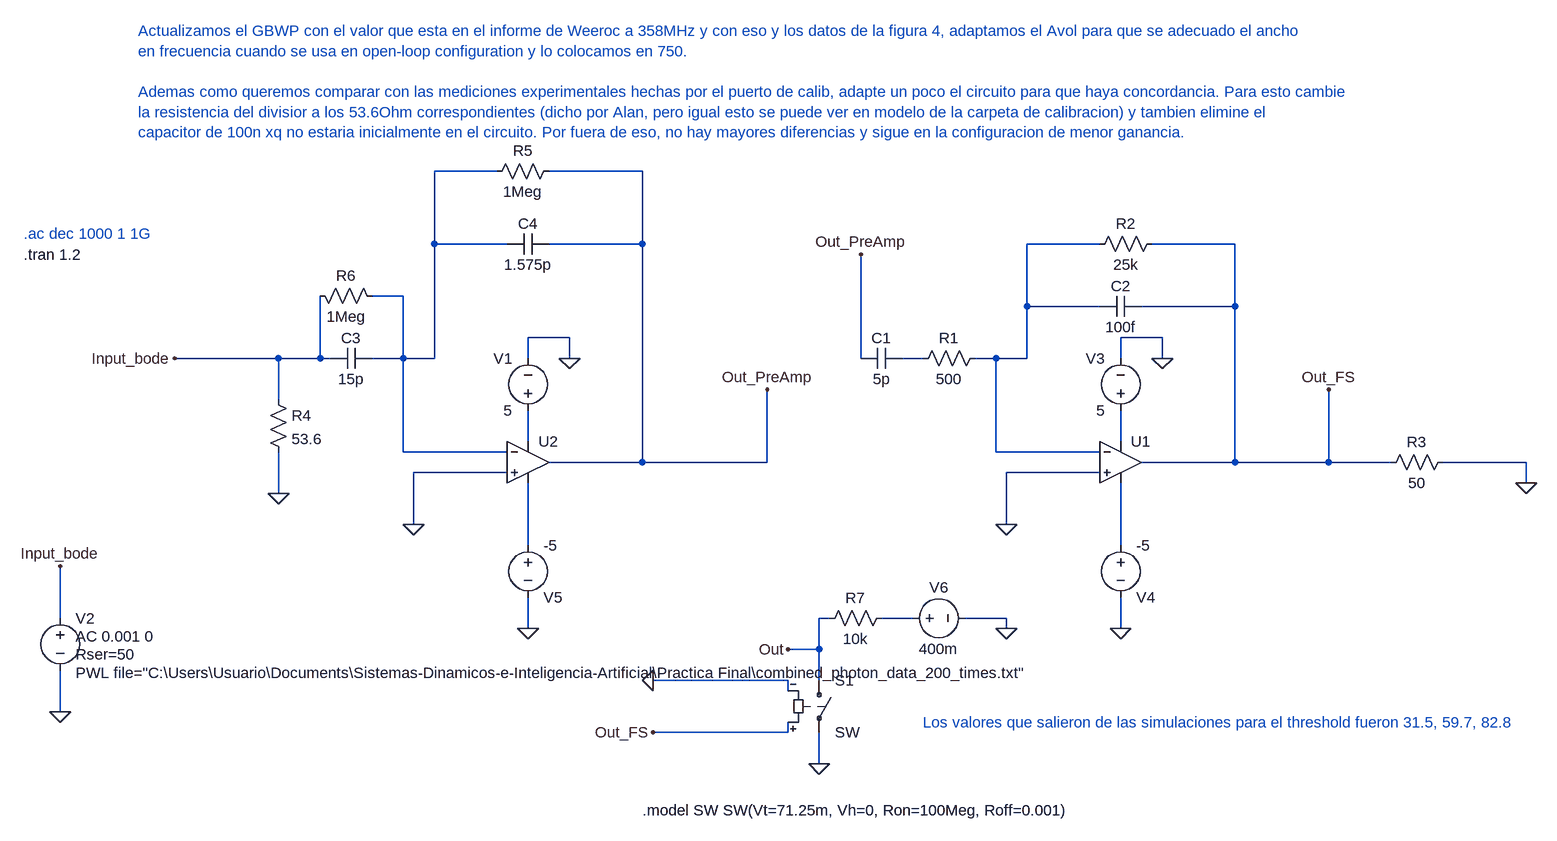
[diagram p0: schematic bode_circuito_completo_con_capacitores_en_preamp_inversor_v2.asc]
bode_circuito_completo_con_capacitores_en_preamp_inversor_v2.asc, the LTspice schematic file:
Version 4
SHEET 1 2516 1220
WIRE -832 -480 -928 -480
WIRE -608 -480 -752 -480
WIRE -928 -368 -928 -480
WIRE -816 -368 -928 -368
WIRE -608 -368 -608 -480
WIRE -608 -368 -752 -368
WIRE 96 -368 -16 -368
WIRE 304 -368 176 -368
WIRE -976 -288 -1024 -288
WIRE -16 -272 -16 -368
WIRE 96 -272 -16 -272
WIRE 304 -272 304 -368
WIRE 304 -272 160 -272
WIRE -720 -224 -784 -224
WIRE 192 -224 128 -224
WIRE -1168 -192 -1328 -192
WIRE -1104 -192 -1104 -288
WIRE -1104 -192 -1168 -192
WIRE -1088 -192 -1104 -192
WIRE -976 -192 -976 -288
WIRE -976 -192 -1024 -192
WIRE -928 -192 -928 -368
WIRE -928 -192 -976 -192
WIRE -784 -192 -784 -224
WIRE -720 -192 -720 -224
WIRE -272 -192 -272 -352
WIRE -176 -192 -208 -192
WIRE -64 -192 -96 -192
WIRE -16 -192 -16 -272
WIRE -16 -192 -64 -192
WIRE 128 -192 128 -224
WIRE 192 -192 192 -224
WIRE -1168 -128 -1168 -192
WIRE -784 -64 -784 -112
WIRE 128 -64 128 -112
WIRE -976 -48 -976 -192
WIRE -816 -48 -976 -48
WIRE -64 -48 -64 -192
WIRE 96 -48 -64 -48
WIRE -608 -32 -608 -368
WIRE -608 -32 -752 -32
WIRE -416 -32 -416 -144
WIRE -416 -32 -608 -32
WIRE 304 -32 304 -272
WIRE 304 -32 160 -32
WIRE 448 -32 448 -144
WIRE 448 -32 304 -32
WIRE 544 -32 448 -32
WIRE 752 -32 624 -32
WIRE -816 -16 -960 -16
WIRE 96 -16 -48 -16
WIRE 752 0 752 -32
WIRE -1168 16 -1168 -48
WIRE -960 64 -960 -16
WIRE -48 64 -48 -16
WIRE -784 96 -784 0
WIRE 128 96 128 0
WIRE -1504 208 -1504 128
WIRE -320 208 -336 208
WIRE -192 208 -240 208
WIRE -48 208 -112 208
WIRE -784 224 -784 176
WIRE -48 224 -48 208
WIRE 128 224 128 176
WIRE -336 256 -336 208
WIRE -336 256 -384 256
WIRE -384 304 -592 304
WIRE -336 304 -336 256
WIRE -384 320 -384 304
WIRE -1504 352 -1504 288
WIRE -384 384 -384 368
WIRE -384 384 -592 384
WIRE -336 432 -336 384
FLAG 192 -192 0
FLAG -48 64 0
FLAG 448 -144 Out_FS
FLAG 752 0 0
FLAG -272 -352 Out_PreAmp
FLAG -1504 352 0
FLAG -1504 128 Input_bode
FLAG -784 224 0
FLAG -720 -192 0
FLAG -960 64 0
FLAG -416 -144 Out_PreAmp
FLAG -1328 -192 Input_bode
FLAG -1168 16 0
FLAG 128 224 0
FLAG -336 432 0
FLAG -48 224 0
FLAG -384 256 Out
FLAG -592 304 0
FLAG -592 384 Out_FS
SYMBOL res -80 -208 R90
WINDOW 0 0 56 VBottom 2
WINDOW 3 32 56 VTop 2
SYMATTR InstName R1
SYMATTR Value 500
SYMBOL res 192 -384 R90
WINDOW 0 0 56 VBottom 2
WINDOW 3 32 56 VTop 2
SYMATTR InstName R2
SYMATTR Value 25k
SYMBOL voltage 128 -96 R180
WINDOW 0 24 96 Left 2
WINDOW 3 24 16 Left 2
WINDOW 123 0 0 Left 0
WINDOW 39 0 0 Left 0
SYMATTR InstName V3
SYMATTR Value 5
SYMBOL OpAmps\\UniversalOpAmp1 128 -32 R0
SYMATTR InstName U1
SYMATTR Value2 Avol=750 GBW=358Meg Vos=0
SYMBOL res 640 -48 R90
WINDOW 0 0 56 VBottom 2
WINDOW 3 32 56 VTop 2
SYMATTR InstName R3
SYMATTR Value 50
SYMBOL cap -208 -208 R90
WINDOW 0 0 32 VBottom 2
WINDOW 3 32 32 VTop 2
SYMATTR InstName C1
SYMATTR Value 5p
SYMBOL cap 160 -288 R90
WINDOW 0 0 32 VBottom 2
WINDOW 3 32 32 VTop 2
SYMATTR InstName C2
SYMATTR Value 100f
SYMBOL voltage -784 -96 R180
WINDOW 0 24 96 Left 2
WINDOW 3 24 16 Left 2
WINDOW 123 0 0 Left 0
WINDOW 39 0 0 Left 0
SYMATTR InstName V1
SYMATTR Value 5
SYMBOL voltage -784 80 R0
WINDOW 0 24 96 Left 2
WINDOW 3 24 16 Left 2
WINDOW 123 0 0 Left 0
WINDOW 39 0 0 Left 0
SYMATTR InstName V5
SYMATTR Value -5
SYMBOL OpAmps\\UniversalOpAmp1 -784 -32 R0
SYMATTR InstName U2
SYMATTR Value2 Avol=750 GBW=358Meg Vos=0
SYMBOL voltage -1504 192 R0
WINDOW 123 24 44 Left 2
WINDOW 39 24 72 Left 2
WINDOW 3 24 100 Left 2
SYMATTR Value2 AC 0.001 0
SYMATTR SpiceLine Rser=50
SYMATTR Value PWL file="C:\Users\Usuario\Documents\Sistemas-Dinamicos-e-Inteligencia-Artificial\Practica Final\combined_photon_data_200_times.txt"
SYMATTR InstName V2
SYMBOL cap -1024 -208 R90
WINDOW 0 0 32 VBottom 2
WINDOW 3 32 32 VTop 2
SYMATTR InstName C3
SYMATTR Value 15p
SYMBOL cap -752 -384 R90
WINDOW 0 0 32 VBottom 2
WINDOW 3 32 32 VTop 2
SYMATTR InstName C4
SYMATTR Value 1.575p
SYMBOL res -1184 -144 R0
SYMATTR InstName R4
SYMATTR Value 53.6
SYMBOL res -736 -496 R90
WINDOW 0 0 56 VBottom 2
WINDOW 3 32 56 VTop 2
SYMATTR InstName R5
SYMATTR Value 1Meg
SYMBOL res -1120 -304 M90
WINDOW 0 0 56 VBottom 2
WINDOW 3 32 56 VTop 2
SYMATTR InstName R6
SYMATTR Value 1Meg
SYMBOL voltage 128 80 R0
WINDOW 0 24 96 Left 2
WINDOW 3 24 16 Left 2
WINDOW 123 0 0 Left 0
WINDOW 39 0 0 Left 0
SYMATTR InstName V4
SYMATTR Value -5
SYMBOL sw -336 288 R0
SYMATTR InstName S1
SYMBOL voltage -208 208 R270
WINDOW 0 32 56 VTop 2
WINDOW 3 -32 56 VBottom 2
WINDOW 123 0 0 Left 0
WINDOW 39 0 0 Left 0
SYMATTR InstName V6
SYMATTR Value 400m
SYMBOL res -224 192 R90
WINDOW 0 0 56 VBottom 2
WINDOW 3 32 56 VTop 2
SYMATTR InstName R7
SYMATTR Value 10k
TEXT -1560 -352 Left 2 !.tran 1.2
TEXT -1560 -384 Left 2 ;.ac dec 1000 1 1G
TEXT -1384 -696 Left 2 ;Actualizamos el GBWP con el valor que esta en el informe de Weeroc a 358MHz y con eso y los datos de la figura 4, adaptamos el Avol para que se adecuado el ancho\nen frecuencia cuando se usa en open-loop configuration y lo colocamos en 750.\n \nAdemas como queremos comparar con las mediciones experimentales hechas por el puerto de calib, adapte un poco el circuito para que haya concordancia. Para esto cambie\nla resistencia del divisior a los 53.6Ohm correspondientes (dicho por Alan, pero igual esto se puede ver en modelo de la carpeta de calibracion) y tambien elimine el \ncapacitor de 100n xq no estaria inicialmente en el circuito. Por fuera de eso, no hay mayores diferencias y sigue en la configuracion de menor ganancia.
TEXT -608 504 Left 2 !.model SW SW(Vt=71.25m, Vh=0, Ron=100Meg, Roff=0.001)
TEXT -176 368 Left 2 ;Los valores que salieron de las simulaciones para el threshold fueron 31.5, 59.7, 82.8

The netlist it stands for:
* bode_circuito_completo_con_capacitores_en_preamp_inversor_v2.asc
R1 N002 N003 500
R2 Out_FS N002 25k
V3 N005 0 5
XU1 0 N002 N005 N007 Out_FS level1 Avol=750 GBW=358Meg Vos=0 En=0 Enk=0 In=0 Ink=0 Rin=500Meg  ; pins In+ In- V+ V- OUT
R3 0 Out_FS 50
C1 N003 Out_PreAmp 5p
C2 Out_FS N002 100f
V1 N004 0 5
V5 N006 0 -5
XU2 0 N001 N004 N006 Out_PreAmp level1 Avol=750 GBW=358Meg Vos=0 En=0 Enk=0 In=0 Ink=0 Rin=500Meg  ; pins In+ In- V+ V- OUT
V2 Input_bode 0 PWL file="C:\Users\Usuario\Documents\Sistemas-Dinamicos-e-Inteligencia-Artificial\Practica Final\combined_photon_data_200_times.txt" AC 0.001 0 Rser=50
C3 N001 Input_bode 15p
C4 Out_PreAmp N001 1.575p
R4 Input_bode 0 53.6
R5 Out_PreAmp N001 1Meg
R6 Input_bode N001 1Meg
V4 N007 0 -5
S1 Out 0 Out_FS 0 SW
V6 N008 0 400m
R7 N008 Out 10k
.tran 1.2
* .ac dec 1000 1 1G
* Actualizamos el GBWP con el valor que esta en el informe de Weeroc a 358MHz y con eso y los datos de la figura 4, adaptamos el Avol para que se adecuado el ancho
* en frecuencia cuando se usa en open-loop configuration y lo colocamos en 750.
* Ademas como queremos comparar con las mediciones experimentales hechas por el puerto de calib, adapte un poco el circuito para que haya concordancia. Para esto cambie
* la resistencia del divisior a los 53.6Ohm correspondientes (dicho por Alan, pero igual esto se puede ver en modelo de la carpeta de calibracion) y tambien elimine el
* capacitor de 100n xq no estaria inicialmente en el circuito. Por fuera de eso, no hay mayores diferencias y sigue en la configuracion de menor ganancia.
.model SW SW(Vt=71.25m, Vh=0, Ron=100Meg, Roff=0.001)
* Los valores que salieron de las simulaciones para el threshold fueron 31.5, 59.7, 82.8
.lib UniversalOpAmp1.lib
.backanno
.end